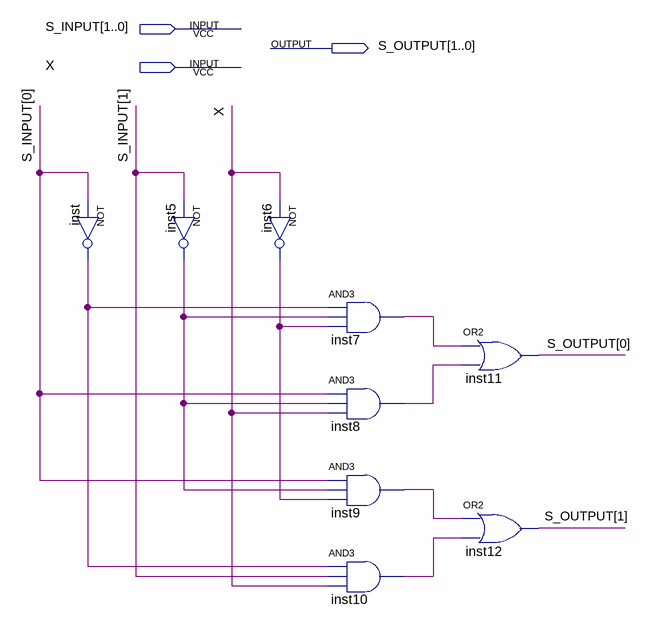
[diagram p0: schematic sheet]
// Quartus schematic INPUT_LOGIC.bdf as structural Verilog: 9 symbols, 3 pins
module INPUT_LOGIC (
  input  [1:0] S_INPUT,
  input  X,
  output [1:0] S_OUTPUT
);

  wire inst5_out, inst6_out, inst7_out, inst8_out, inst9_out, inst10_out, inst_out;

  not inst (inst_out, S_INPUT[0]);
  not inst5 (inst5_out, S_INPUT[1]);
  not inst6 (inst6_out, X);
  and inst7 (inst7_out, inst_out, inst5_out, inst6_out);
  and inst8 (inst8_out, S_INPUT[0], inst5_out, X);
  and inst9 (inst9_out, S_INPUT[0], inst5_out, inst6_out);
  and inst10 (inst10_out, inst_out, S_INPUT[1], X);
  or inst11 (S_OUTPUT[0], inst7_out, inst8_out);
  or inst12 (S_OUTPUT[1], inst9_out, inst10_out);
endmodule
